# Altium schematic sheet 06_USB_HUB20.SchDoc: USB Hub 2.0
size B; DocumentNumber: 5; Revision: V1.0; SheetNumber: 5; SheetTotal: 12
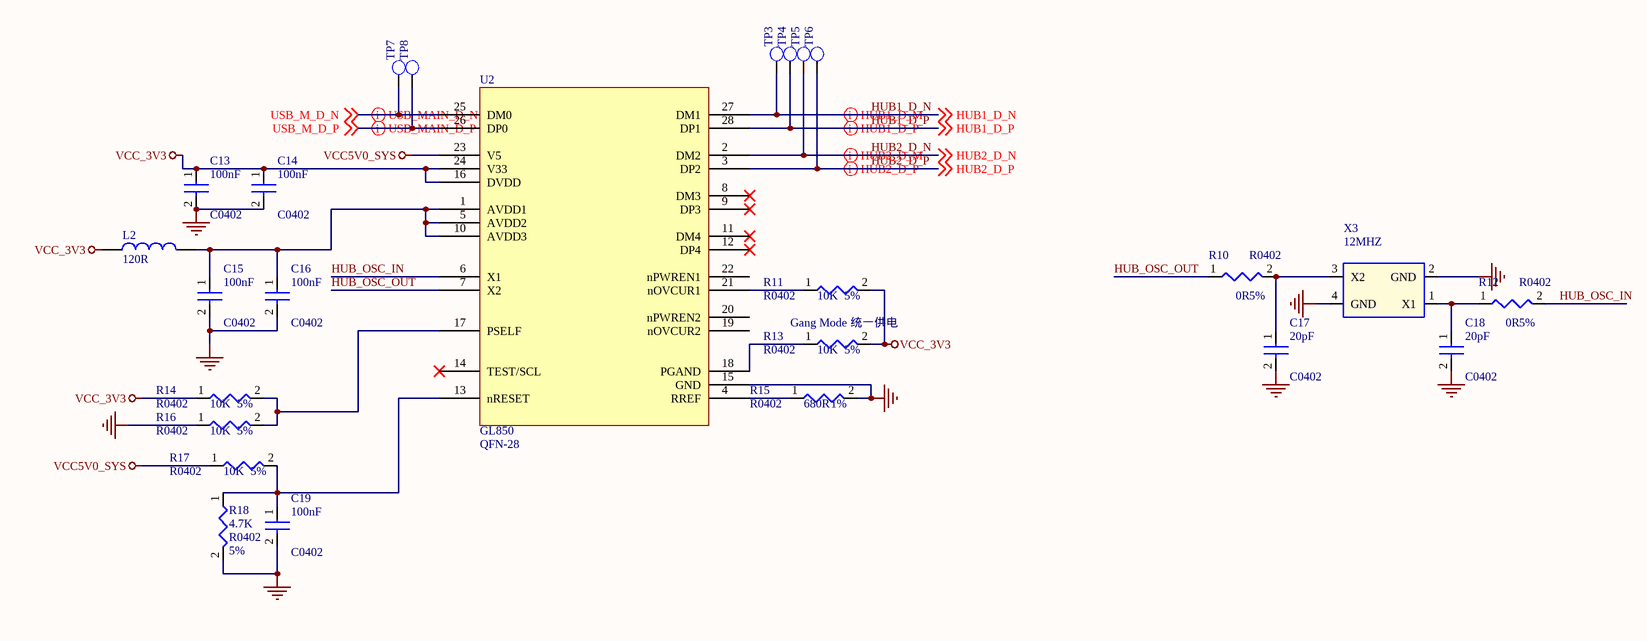
[diagram p0: 06_USB_HUB20.SchDoc]

## Parts
C13  100nF  PCB Footprint: C0402  [C0402_L]
C14  100nF  PCB Footprint: C0402  [C0402_L]
C15  100nF  PCB Footprint: C0402  [C0402_L]
C16  100nF  PCB Footprint: C0402  [C0402_L]
C17  20pF  PCB Footprint: C0402  [C0402_L]
C18  20pF  PCB Footprint: C0402  [C0402_L]
C19  100nF  PCB Footprint: C0402  [C0402_L]
L2  120R  [L0402]
R10  0R  Tolerance: 5%  [R0402]
R11  10K  Tolerance: 5%  [R0402]
R12  0R  Tolerance: 5%  [R0402]
R13  10K  Tolerance: 5%  [R0402]
R14  10K  Tolerance: 5%  [R0402]
R15  680R  Tolerance: 1%  [R0402]
R16  10K  Tolerance: 5%  [R0402]
R17  10K  Tolerance: 5%  [R0402]
R18  4.7K  Tolerance: 5%  [R0402]
TP3  (no value)  [TP_0R70]  (no BOM)
TP4  (no value)  [TP_0R70]  (no BOM)
TP5  (no value)  [TP_0R70]  (no BOM)
TP6  (no value)  [TP_0R70]  (no BOM)
TP7  (no value)  [TP_0R70]  (no BOM)
TP8  (no value)  [TP_0R70]  (no BOM)
U2  GL850  [QFN-28]
X3  12MHZ  [XTAL_3225-8MHZ]

## Nets
GND: C13.2 C14.2 C15.2 C16.2 C17.2 C18.2 C19.2 R15.2 R16.1 R18.2 U2.15(GND) X3.2(GND) X3.4(GND)
VCC5V0_SYS: R17.1 U2.23(V5)
VCC_3V3: C13.1 C14.1 L2.1 R11.2 R13.2 R14.1 U2.16(DVDD) U2.24(V33)
HUB1_D_N: TP3.1 U2.27(DM1) ; off-sheet HUB1_D_N
HUB1_D_P: TP4.1 U2.28(DP1) ; off-sheet HUB1_D_P
HUB2_D_N: TP5.1 U2.2(DM2) ; off-sheet HUB2_D_N
HUB2_D_P: TP6.1 U2.3(DP2) ; off-sheet HUB2_D_P
HUB_OSC_IN: R12.2 U2.6(X1)
HUB_OSC_OUT: R10.1 U2.7(X2)
USB_M_D_N: TP7.1 U2.25(DM0) ; off-sheet USB_M_D_N
USB_M_D_P: TP8.1 U2.26(DP0) ; off-sheet USB_M_D_P
NetC15_1: C15.1 C16.1 L2.2 U2.1(AVDD1) U2.5(AVDD2) U2.10(AVDD3)
NetC17_1: C17.1 R10.2 X3.3(X2)
NetC18_1: C18.1 R12.1 X3.1(X1)
NetC19_1: C19.1 R17.2 R18.1 U2.13(nRESET)
NetR11_1: R11.1 U2.21(nOVCUR1)
NetR13_1: R13.1 U2.18(PGAND)
NetR14_2: R14.2 R16.2 U2.17(PSELF)
NetR15_1: R15.1 U2.4(RREF)

Not connected (* = marked no-connect by the designer): U2 8(DM3)* 9(DP3)* 11(DM4)* 12(DP4)* 14(TEST/SCL)* 19(nOVCUR2) 20(nPWREN2) 22(nPWREN1)

## Layout directives
differential pair; differential pair class USB: HUB1_D_N, HUB1_D_P, HUB2_D_N, HUB2_D_P, USB_M_D_N, USB_M_D_P

## Notes on the sheet
- (near R13) Gang Mode 统一供电
- Title
- Size:
- Date:
- B
- Number:
- Time:
- Revision:
- Sheet
- of
- Author: Edward Lai
- Email: edward@vibe.us
- Vibe Inc
- Hangzhou
- vibe.us <http://vibe.us>
- File:

## Library data of the parts
C13-C16 C19 = CAP NP_Dup1: cap,100.00nF,+/-10%,10V,X5R,C0402; Priority: A; Part Type: C0402
C17 C18 = CAP NP_Dup1: cap,20pF,+/-10%,25V,X5R,C0402; Priority: A; Part Type: C0402
L2 = L: 鐵氧體磁珠 120 OHM 25%
R10 R12 = RESISTOR: 通用厚膜电阻,0R,+/-5%,R0402; Priority: A; PCB Footprint: R0402; Part Type: 通用厚膜电阻
R11 R13 R14 R16 R17 = RESISTOR: 通用厚膜电阻,10K,+/-5%,R0402; Priority: A; PCB Footprint: R0402; Part Type: 通用厚膜电阻
R15 = RESISTOR: 通用厚膜电阻,680R,+/-1%,R0402; Priority: A; PCB Footprint: R0402; Part Type: 通用厚膜电阻
R18 = RESISTOR: 通用厚膜电阻,4.7K,+/-5%,R0402; Priority: A; PCB Footprint: R0402; Part Type: 通用厚膜电阻
TP3-TP8 = TP: Test Point 0.7mm; PCB Footprint: TP_0R50; Priority: A; Part Type: TP
U2 = GL850G: GL850 4 Port USB HUB QFN-28; Package: QFN-28
X3 = CRYSTAL_4P: 12MHZ (16pF), 3.2 mm x 2.5 mm / 无源晶振(谐振器）